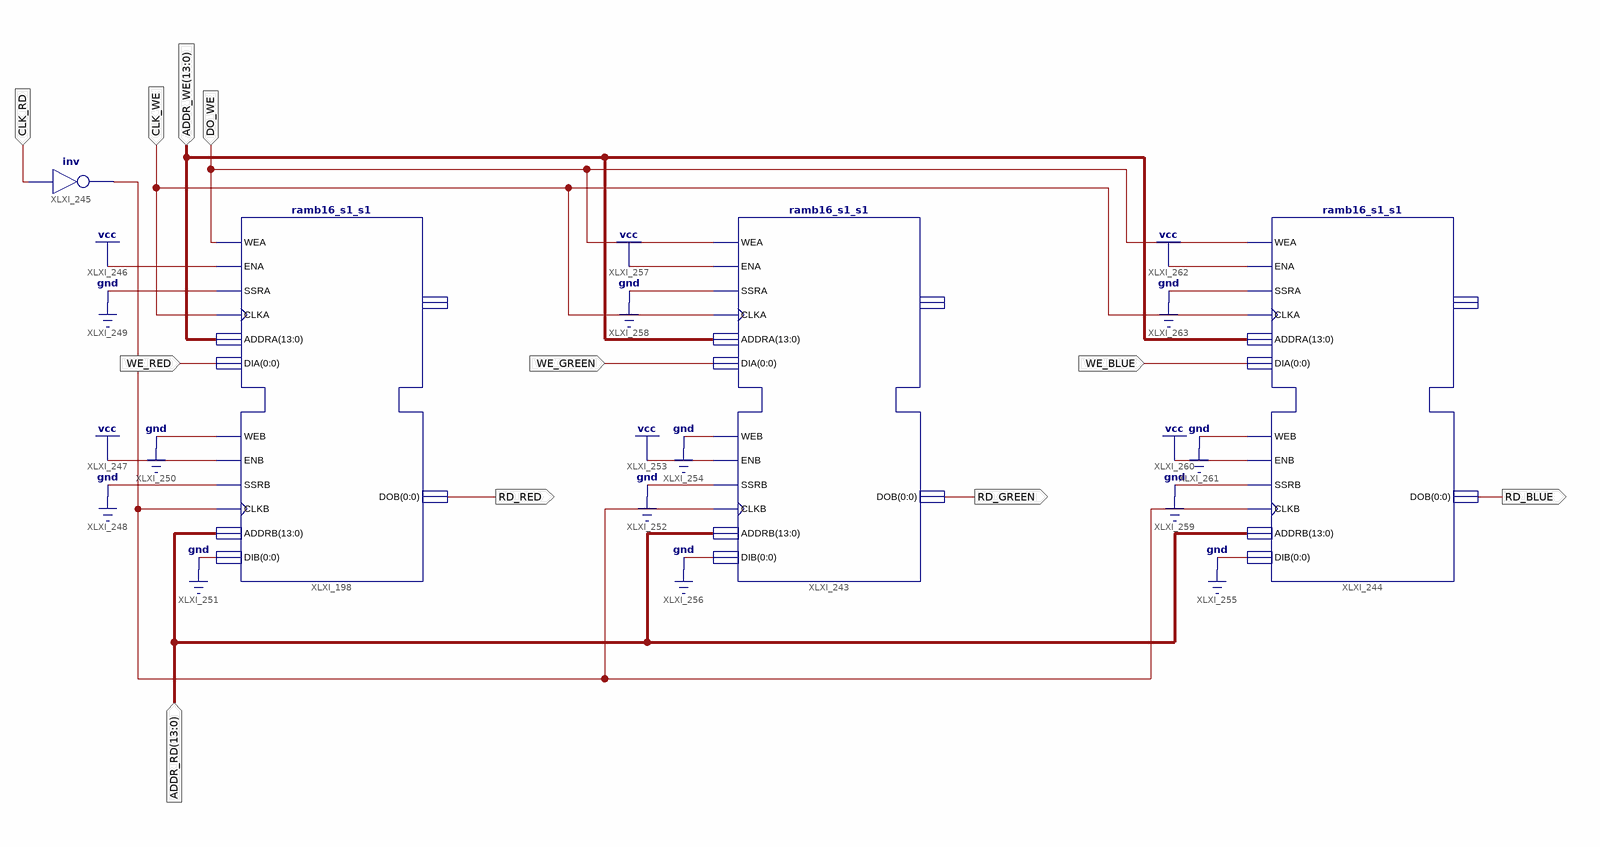
[diagram p0: schematic sheet 1]
// Xilinx ISE schematic RAM_A14_D8_synchrone.sch (spartan3) as structural Verilog: 4 symbols, 11 ports
module RAM_A14_D8_synchrone (
  input  CLK_RD,
  input  CLK_WE,
  input  [13:0] ADDR_WE,
  input  [13:0] ADDR_RD,
  input  WE_RED,
  input  DO_WE,
  input  WE_GREEN,
  input  WE_BLUE,
  output RD_RED,
  output RD_GREEN,
  output RD_BLUE
);

  wire XLXN_120;

  ramb16_s1_s1 XLXI_198 (
    .ADDRA(ADDR_WE), .ADDRB(ADDR_RD), .CLKA(CLK_WE), .CLKB(XLXN_120), .DIA(WE_RED), .DIB(1'b0), .ENA(1'b1),
    .ENB(1'b1), .SSRA(1'b0), .SSRB(1'b0), .WEA(DO_WE), .WEB(1'b0), .DOB(RD_RED));  // open: DOA
  ramb16_s1_s1 XLXI_243 (
    .ADDRA(ADDR_WE), .ADDRB(ADDR_RD), .CLKA(CLK_WE), .CLKB(XLXN_120), .DIA(WE_GREEN), .DIB(1'b0), .ENA(1'b1),
    .ENB(1'b1), .SSRA(1'b0), .SSRB(1'b0), .WEA(DO_WE), .WEB(1'b0), .DOB(RD_GREEN));  // open: DOA
  ramb16_s1_s1 XLXI_244 (
    .ADDRA(ADDR_WE), .ADDRB(ADDR_RD), .CLKA(CLK_WE), .CLKB(XLXN_120), .DIA(WE_BLUE), .DIB(1'b0), .ENA(1'b1),
    .ENB(1'b1), .SSRA(1'b0), .SSRB(1'b0), .WEA(DO_WE), .WEB(1'b0), .DOB(RD_BLUE));  // open: DOA
  not XLXI_245 (XLXN_120, CLK_RD);
endmodule
